# Altium schematic sheet fuseV0.1.SchDoc
size A4; SheetNumber: 1; SheetTotal: 3
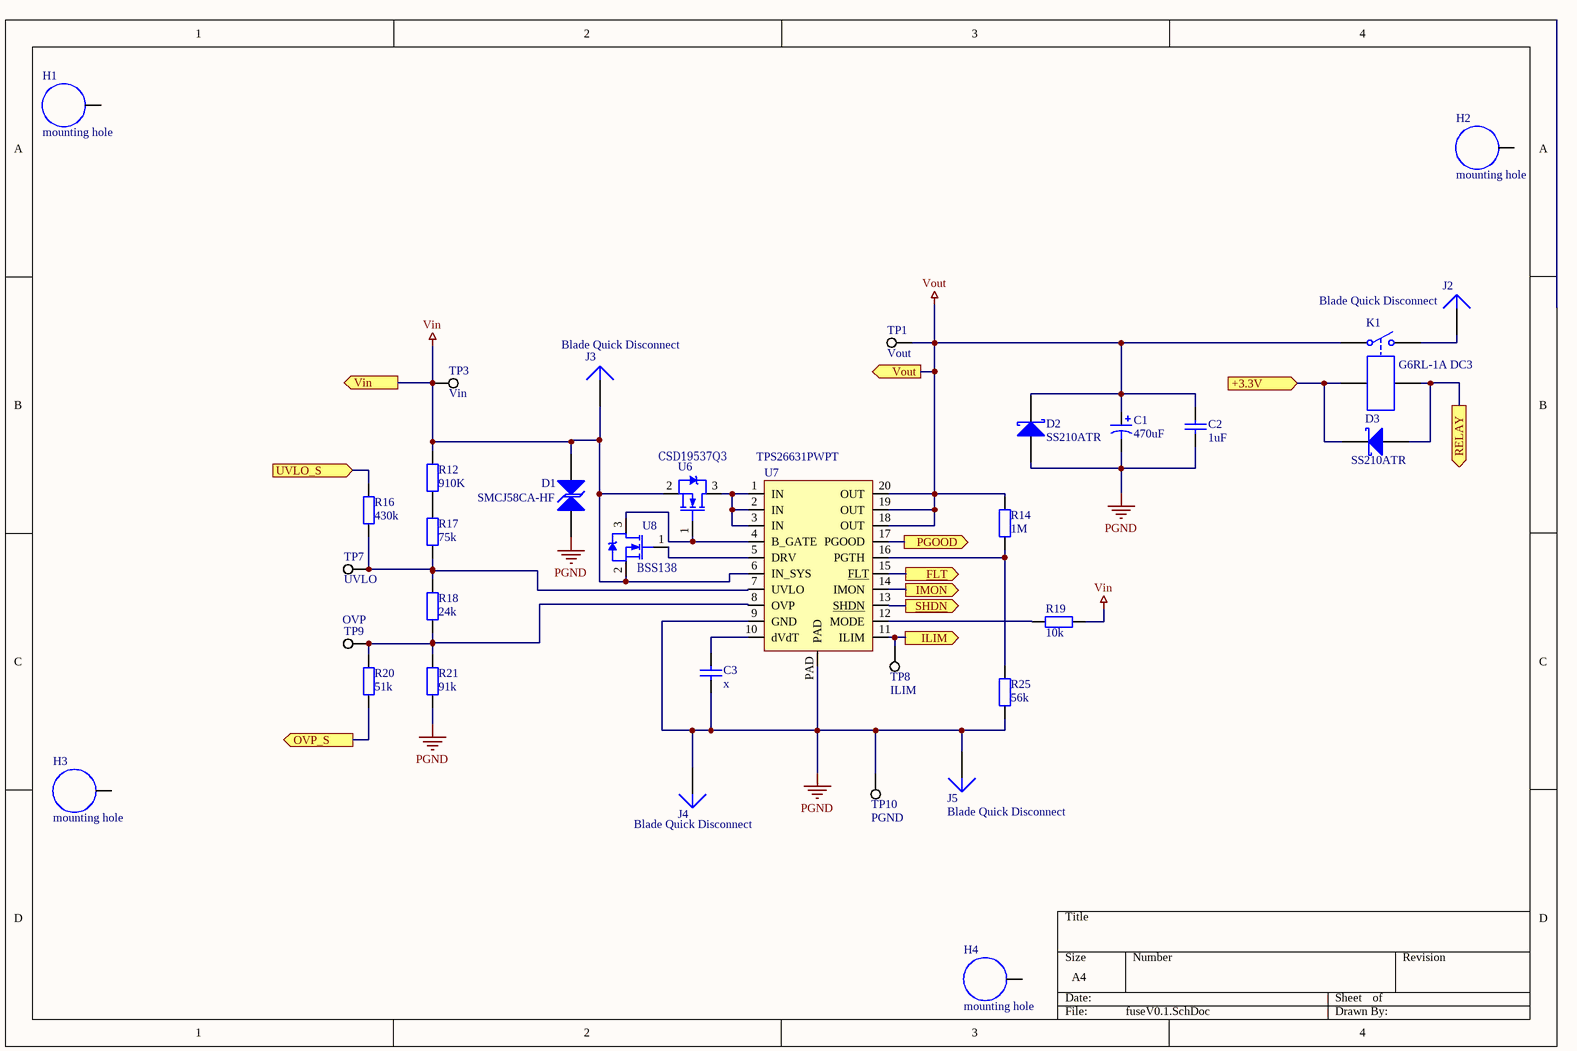
[diagram p0: fuseV0.1.SchDoc]

## Parts
C1  470uF  [CAP_16MM_SMD]
C2  1uF  [0805]
C3  x  [0805]
D1  SMCJ58CA-HF  [DO-214AB-SMC Bipolar]
D2  SS210ATR  [DO-214AC, SMA]
D3  SS210ATR  [DO-214AC, SMA]
H1  mounting hole  [M3 HOLE iso]
H2  mounting hole  [M3 HOLE iso]
H3  mounting hole  [M3 HOLE iso]
H4  mounting hole  [M3 HOLE iso]
J2  Blade Quick Disconnect  [TE blade connector]
J3  Blade Quick Disconnect  [TE blade connector]
J4  Blade Quick Disconnect  [TE blade connector]
J5  Blade Quick Disconnect  [TE blade connector]
K1  G6RL-1A DC3  [G6RL-1A DC3 relay]
R12  910K  [0805]
R14  1M  [0805]
R16  430k  [0805]
R17  75k  [0805]
R18  24k  [0805]
R19  10k  [0805]
R20  51k  [0805]
R21  91k  [0805]
R25  56k  [0805]
TP1  Vout  [Test Loop 1.6mm]
TP3  Vin  [Test Loop 1.6mm]
TP7  UVLO  [Test Loop 1.6mm]
TP8  ILIM  [Test Loop 1.6mm]
TP9  OVP  [Test Loop 1.6mm]
TP10  PGND  [Test Loop 1.6mm]
U6  ‎CSD19537Q3‎  [8-VSON (3,3x3,3)]
U7  TPS26631PWPT  [TSSOP_P065S6.6x6.6]
U8  BSS138‎  [SOT-23-3]

## Ports
+3.3V (in), FLT (out), ILIM (out), IMON (out), OVP_S (out), PGOOD (out), RELAY (out), SHDN (out), UVLO_S (in), Vin (out), Vout (out)

## Nets
PGND: C1.2 C2.1 C3.2 D1.1(A) D2.1(A) J4.1 J5.1 R21.1 R25.1 TP10.1 U7.9(GND) U7.PAD
Vin: D1.2(K) J3.1 R12.2 R19.1 TP3.1 U6.2(D) U7.6(IN_SYS) U8.2(D) ; port Vin
Vout: C1.1 C2.2 D2.2(K) K1.2 R14.2 TP1.1 U7.18(OUT) U7.19(OUT) U7.20(OUT) ; port Vout
+3.3V: D3.2(K) K1.1 ; port +3.3V
FLT: U7.15(FLT) ; port FLT
ILIM: TP8.1 U7.11(ILIM) ; port ILIM
IMON: U7.14(IMON) ; port IMON
OVP_S: R20.1 ; port OVP_S
PGOOD: U7.17(PGOOD) ; port PGOOD
RELAY: D3.1(A) K1.5 ; port RELAY
SHDN: U7.13(SHDN) ; port SHDN
UVLO_S: R16.2 ; port UVLO_S
NetC3_1: C3.1 U7.10(dVdT)
NetJ2_1: J2.1 K1.3
NetR12_1: R12.1 R17.2
NetR14_1: R14.1 R25.2 U7.16(PGTH)
NetR16_1: R16.1 R17.1 R18.2 TP7.1 U7.7(UVLO)
NetR18_1: R18.1 R20.2 R21.2 TP9.1 U7.8(OVP)
NetR19_2: R19.2 U7.12(MODE)
NetU6_1: U6.1(G) U7.4(B_GATE) U8.3(S)
NetU6_3: U6.3(S) U7.1(IN) U7.2(IN) U7.3(IN)
NetU7_5: U7.5(DRV) U8.1(G)

Not connected (* = marked no-connect by the designer): H1 1; H2 1; H3 1; H4 1

## Library data of the parts
C1 = cap pol
C2 C3 = cap
D1 = TVS Diode
D2 D3 = shotkey diode
K1 = Relay
R12 R14 R16-R21 R25 = res0805
TP1 TP3 TP7-TP10 = Test point
U6 U8 = N-mosfet en